# Altium schematic sheet 4c - Latching BSPD.SchDoc
size A4
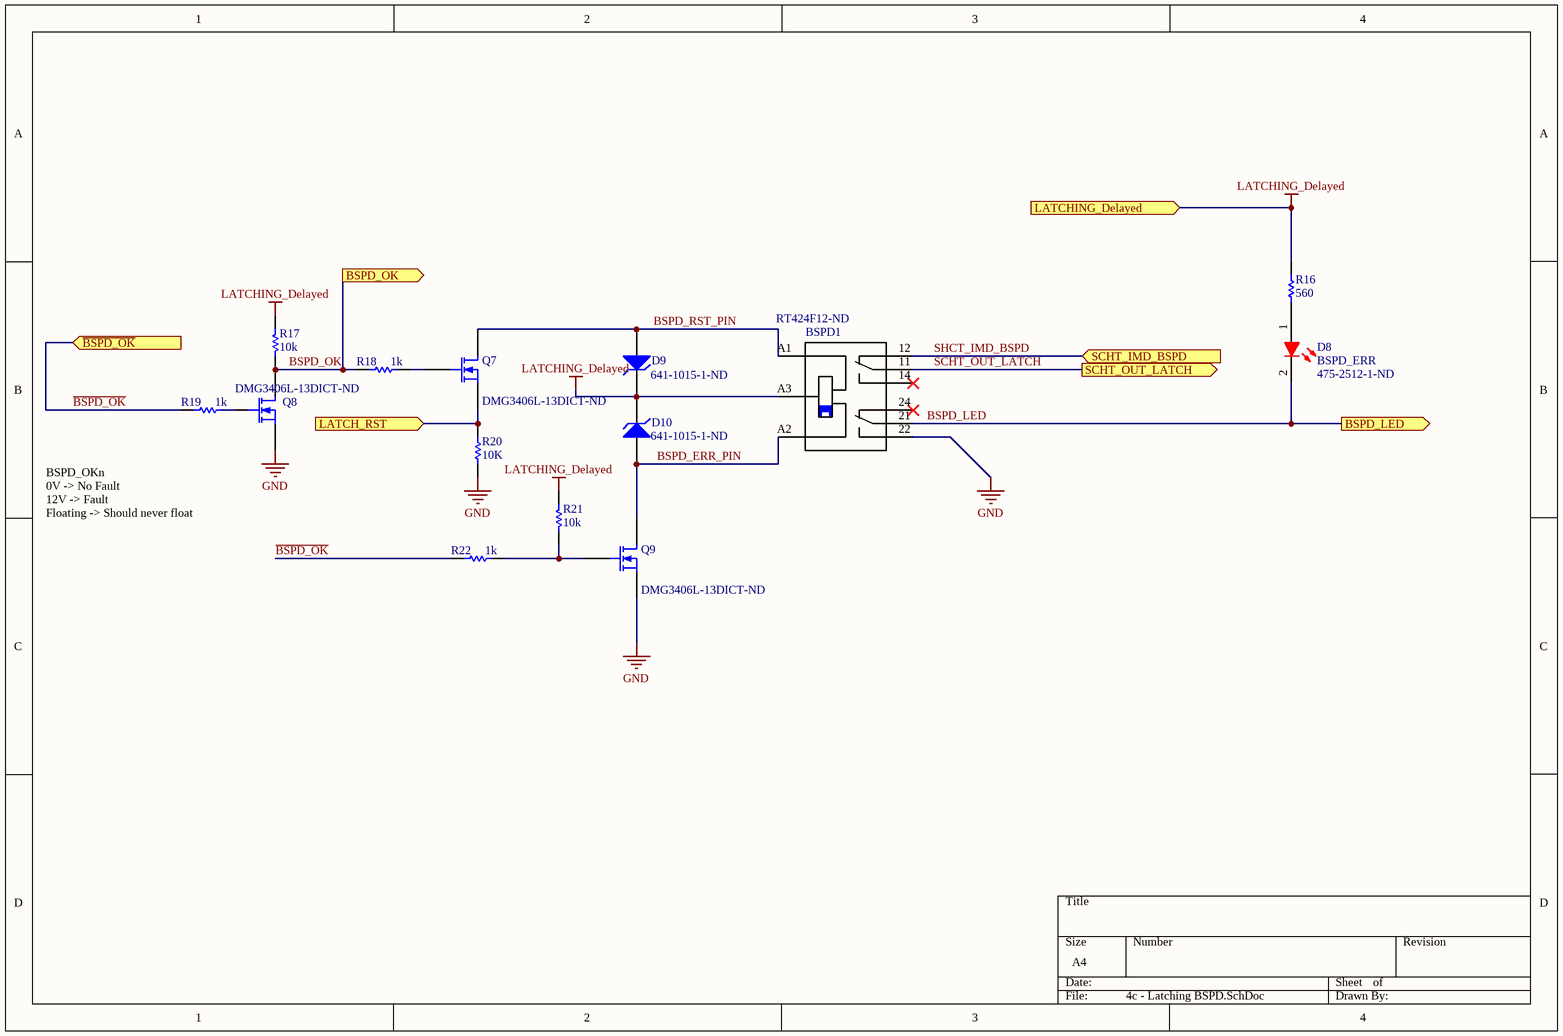
[diagram p0: 4c - Latching BSPD.SchDoc]

## Parts
BSPD1  Supplier Part Number 1: RT424F12-ND  [TE_5-1393243-4]  (hidden comment: 5-1393243-4)
D8  BSPD_ERR  Supplier Part Number 1: 475-2512-1-ND  [TOSH-0603LED_RED_V]
D9  Supplier Part Number 1: 641-1015-1-ND  [DO214AC]  (hidden comment: D Zener)
D10  Supplier Part Number 1: 641-1015-1-ND  [DO214AC]  (hidden comment: D Zener)
Q7  Supplier Part Number 1: DMG3406L-13DICT-ND  [SOT-23_N]
Q8  Supplier Part Number 1: DMG3406L-13DICT-ND  [SOT-23_N]
Q9  Supplier Part Number 1: DMG3406L-13DICT-ND  [SOT-23_N]
R16  560  [RESC0603(1608)_L]
R17  Resistance (Ohms): 10k  [1608[0603]]  (hidden comment: RHM1.0KDCT-ND)
R18  value 1k  [1608[0603]]  (hidden comment: Res1)
R19  value 1k  [1608[0603]]  (hidden comment: Res1)
R20  value 10K  [1608[0603]]  (hidden comment: Res1)
R21  Resistance (Ohms): 10k  [1608[0603]]  (hidden comment: RHM1.0KDCT-ND)
R22  value 1k  [1608[0603]]  (hidden comment: Res1)

## Ports
BSPD_LED (out), BSPD_OK (out), LATCH_RST (in), LATCHING_Delayed (in), SCHT_IMD_BSPD (in), SCHT_OUT_LATCH (out), ~{BSPD_OK} (in)

## Nets
GND: BSPD1.22 Q8.2(S) Q9.2(S) R20.1
LATCHING_Delayed: BSPD1.A3 D9.2(K) D10.2(K) R16.2 R17.1 R21.1 ; port LATCHING_Delayed
~{BSPD_OK}: R19.1 R22.1 ; port ~{BSPD_OK}
BSPD_ERR_PIN: BSPD1.A2 D10.1(A) Q9.3(D)
BSPD_LED: BSPD1.21 D8.2(K) ; port BSPD_LED
BSPD_OK: Q8.3(D) R17.2 R18.1 ; port BSPD_OK
BSPD_RST_PIN: BSPD1.A1 D9.1(A) Q7.3(D)
LATCH_RST: Q7.2(S) R20.2 ; port LATCH_RST
SCHT_OUT_LATCH: BSPD1.11 ; port SCHT_OUT_LATCH
SHCT_IMD_BSPD: BSPD1.12 ; port SCHT_IMD_BSPD
NetD8_1: D8.1(A) R16.1
NetQ7_1: Q7.1(G) R18.2
NetQ8_1: Q8.1(G) R19.2
NetQ9_1: Q9.1(G) R21.2 R22.2

Not connected (* = marked no-connect by the designer): BSPD1 14* 24*

## Notes on the sheet
- BSPD_OKn
  0V -> No Fault
  12V -> Fault
  Floating -> Should never float

## Library data of the parts
BSPD1 = 5-1393243-4: Electromechanical Relay 12VDC 240Ohm 15A DPDT __ 29mm 12.7mm 15.7mm__ THT Power Relay; MF: TE Connectivity; TE_purchase_URL: https://www.te.com/usa-en/product-5-1393243-4.html?te_bu=Cor&te_type=disp&te_campaign=seda_glo_cor-seda-global-disp-prtnr-fy19-seda-model-bom-cta_sma-317_1&elqCampaignId=32493; Package: None; MP: 5-1393243-4; Digi-Key_Purchase_URL: *; Digi-Key_Part_Number: *; SnapEDA_Link: https://www.snapeda.com/parts/5-1393243-4/TE%20Connectivity/view-part/?ref=snap; Value: *; Supplier 1: Digi-Key
D8 = CMP-0444-00001-1: LED, Red 0603 (1608) 63mCd; Manufacturer: Toshiba; PartNumber: TLSU1008A(T04); Forward Current: 25 mA; Power Dissipation: 60 mW; Packing Type: Reel; Reverse Voltage: 4 V; Mounting Technology: Surface Mount; PackageDescription: 2-Pin SMT LED, 1.6 x 0.8 mm Pitch; ComponentLink1URL: http://www.toshiba-components.com/; ComponentLink1Description: Manufacturer URL; PackageReference: 0603LED_RED; ComponentLink2URL: http://www.semicon.toshiba.co.jp/info/docget.jsp?type=datasheet&lang=en&pid=TLSU1008A(T04); ComponentLink2Description: Datasheet; DatasheetVersion: Aug-08; Storage Temperature: -40 to 100 degC; Supplier 1: Digi-Key
D9 D10 = D Zener: Zener Diode; Published: 8-Jun-2000; LatestRevisionDate: 17-Jul-2002; LatestRevisionNote: Re-released for DXP Platform.; PackageReference: DIODE-0.7; Publisher: Altium Limited; PackageDescription: Diode, Thru-Hole; 2 Leads; 0.7 in Pin Spacing; Supplier 1: Digi-Key
Q7-Q9 = MOSFET-N: N-Channel MOSFET; Manufacturer: Infineon Technologies; FET Type: MOSFET N-Channel, Metal Oxide; FET Feature: Logic Level Gate; Drain to Source Voltage (Vdss): 30V; Current - Continuous Drain (Id) @ 25°C: 50A (Tc); Rds On (Max) @ Id, Vgs: 7.5 mOhm @ 30A, 10V; Vgs(th) (Max) @ Id: 2.2V @ 250µA; Gate Charge (Qg) @ Vgs: 18nC @ 10V; Input Capacitance (Ciss) @ Vds: 1900pF @ 15V; Power - Max: 47W; Published: 8-Jun-2000; LatestRevisionDate: 17-Jul-2002; LatestRevisionNote: Re-released for DXP Platform.; PackageVersion: 1995/1996; PackageReference: E3; Publisher: Altium Limited; PackageDescription: TO, Flat Index; 3 In-Line, Axial Leads; Body Dia. 4.6mm; Lead Dia. 0.5 mm (max); RoHS: RoHS Compliant; Category: Discrete Semiconductor Products; Packaging: Cut Tape (CT); Mounting Type: Surface Mount; Package / Case: TO-252-3, DPak (2 Leads + Tab), SC-63; Supplier Device Package: PG-TO252-3; ComponentLink1URL: http://www.infineon.com/dgdl/Infineon-IPD075N03LG-DS-v02_01-en.pdf?folderId=5546d4694909da4801490a07012f053b&fileId=db3a30431936bc4b011951d824f83aeb; ComponentLink1Description: http://www.infineon.com/dgdl/Infineon-IPD075N03LG-DS-v02_01-en.pdf?folderId=5546d4694909da4801490a07012f053b&fileId=db3a30431936bc4b011951d824f83aeb; ComponentLink2URL: http://www.semicon.toshiba.co.jp/info/docget.jsp?type=datasheet&lang=en&pid=SSM3K329R; ComponentLink2Description: http://www.semicon.toshiba.co.jp/info/docget.jsp?type=datasheet&lang=en&pid=SSM3K329R; Supplier 1: Digi-Key
R16 = CMP-1591-00001-1: 0603 (1608 Metric) Chip Resistor; Case-Metric: 1608; Case-EIA: 0603; PackageReference: RESC0603(1608); Supplier 1: Digi-Key; Supplier Part Number 1: A129685CT-ND
R17 R21 = Res1: RES SMD 1.0K OHM 5% 1/4W 0603; Manufacturer: Rohm Semiconductor; Manufacturer Part Number: ESR03EZPJ102; Power (Watts): 0.25W, 1/4W; Temperature Coefficient: ±200ppm/°C; RoHS: RoHS Compliant; Category: Resistors; Stock 1: 220; Pricing 1: 1=0.15, 10=0.119, 25=0.0824, 50=0.0642, 100=0.0458, 250=0.03568, 500=0.02836, 1000=0.02012 (CAD); Packaging: Cut Tape (CT); Part Status: Active; Tolerance: ±5%; Composition: Thick Film; Features: Automotive AEC-Q200, Pulse Withstanding; Operating Temperature: -55°C ~ 155°C; Package / Case: 0603 (1608 Metric); Supplier Device Package: 0603; Size / Dimension: 0.063" L x 0.031" W (1.60mm x 0.80mm); Height - Seated (Max): 0.022" (0.55mm); Failure Rate: -; ComponentLink1URL: http://rohmfs.rohm.com/en/products/databook/datasheet/passive/resistor/chip_resistor/esr.pdf; ComponentLink1Description: http://rohmfs.rohm.com/en/products/databook/datasheet/passive/resistor/chip_resistor/esr.pdf; Supplier 1: Digi-Key; Supplier Part Number 1: 311-10KGRCT-ND
R18 R19 R22 = Res1: RES SMD 100 OHM 5% 1/4W 0603; Manufacturer: Rohm Semiconductor; Manufacturer Part Number: ESR03EZPJ101; Resistance (Ohms): 100; Power (Watts): 0.25W, 1/4W; Temperature Coefficient: ±200ppm/°C; Published: 8-Jun-2000; LatestRevisionDate: 17-Jul-2002; LatestRevisionNote: Re-released for DXP Platform.; PackageReference: AXIAL-0.3; Publisher: Altium Limited; PackageDescription: Axial Device, Thru-Hole; 2 Leads; 0.3 in Pin Spacing; RoHS: RoHS Compliant; Category: Resistors; Stock 1: 57430; Pricing 1: 1=0.15, 10=0.119, 25=0.0824, 50=0.0642, 100=0.0458, 250=0.03568, 500=0.02836, 1000=0.02012 (CAD); Packaging: Cut Tape (CT); Part Status: Active; Tolerance: ±5%; Composition: Thick Film; Features: Automotive AEC-Q200, Pulse Withstanding; Operating Temperature: -55°C ~ 155°C; Package / Case: 0603 (1608 Metric); Supplier Device Package: 0603; Size / Dimension: 0.063" L x 0.031" W (1.60mm x 0.80mm); Height - Seated (Max): 0.022" (0.55mm); Failure Rate: -; ComponentLink1URL: http://rohmfs.rohm.com/en/products/databook/datasheet/passive/resistor/chip_resistor/esr.pdf; ComponentLink1Description: http://rohmfs.rohm.com/en/products/databook/datasheet/passive/resistor/chip_resistor/esr.pdf; Supplier 1: Digi-Key; Supplier Part Number 1: 311-1.0KGRCT-ND
R20 = Res1: RES SMD 10K OHM 5% 1/4W 0603; Manufacturer: Rohm Semiconductor; Manufacturer Part Number: ESR03EZPJ103; Power (Watts): 0.25W, 1/4W; Temperature Coefficient: ±200ppm/°C; Published: 8-Jun-2000; LatestRevisionDate: 17-Jul-2002; LatestRevisionNote: Re-released for DXP Platform.; PackageReference: AXIAL-0.3; Publisher: Altium Limited; PackageDescription: Axial Device, Thru-Hole; 2 Leads; 0.3 in Pin Spacing; RoHS: RoHS Compliant; Category: Resistors; Stock 1: 0; Pricing 1: 1=0.15, 10=0.119, 25=0.0824, 50=0.0642, 100=0.0458, 250=0.03568, 500=0.02836, 1000=0.02012 (CAD); Packaging: Cut Tape (CT); Resistance (Ohms): 10k; Tolerance: ±5%; Composition: Thick Film; Features: Automotive AEC-Q200, Pulse Withstanding; Operating Temperature: -55°C ~ 155°C; Package / Case: 0603 (1608 Metric); Supplier Device Package: 0603 (1608 Metric); Size / Dimension: 0.063" L x 0.031" W (1.60mm x 0.80mm); Height: 0.022" (0.55mm); Number of Terminations: 2; ComponentLink1URL: http://rohmfs.rohm.com/en/products/databook/datasheet/passive/resistor/chip_resistor/esr.pdf; ComponentLink1Description: http://rohmfs.rohm.com/en/products/databook/datasheet/passive/resistor/chip_resistor/esr.pdf; Part Status: Active; Height - Seated (Max): 0.022" (0.55mm); Failure Rate: -; Supplier 1: Digi-Key; Supplier Part Number 1: 311-10KGRCT-ND